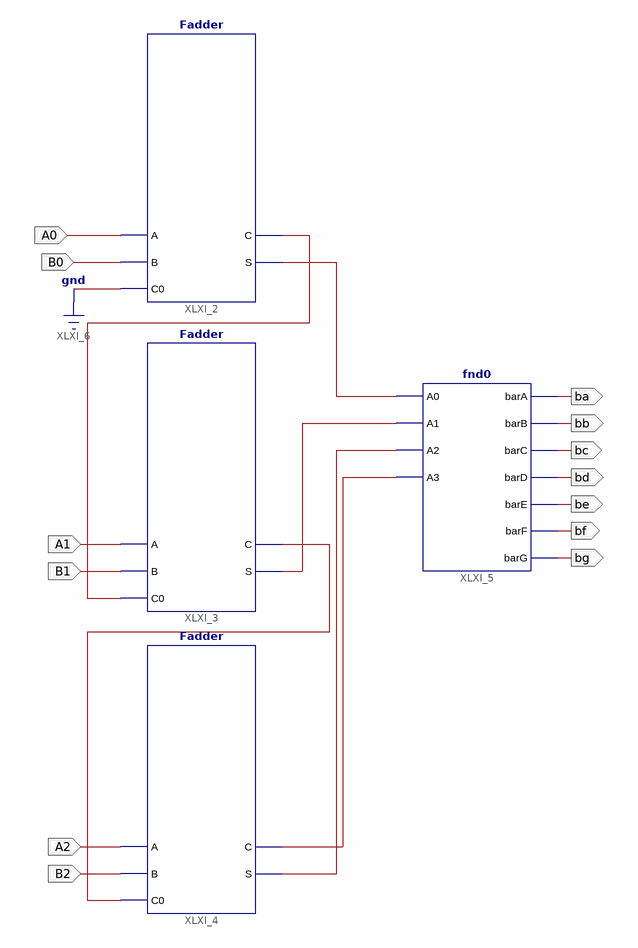
[diagram p0: schematic sheet 1]
// Xilinx ISE schematic fadder31.sch (spartan6) as structural Verilog: 4 symbols, 13 ports
module fadder31 (
  input  A0,
  input  A2,
  input  B2,
  input  B1,
  input  A1,
  input  B0,
  output ba,
  output bb,
  output bc,
  output bd,
  output be,
  output bf,
  output bg
);

  wire XLXN_1, XLXN_3, XLXN_6, XLXN_7, XLXN_8, XLXN_9;

  Fadder XLXI_2 (.A(A0), .B(B0), .C0(1'b0), .C(XLXN_1), .S(XLXN_6));
  Fadder XLXI_3 (.A(A1), .B(B1), .C0(XLXN_1), .C(XLXN_3), .S(XLXN_7));
  Fadder XLXI_4 (.A(A2), .B(B2), .C0(XLXN_3), .C(XLXN_9), .S(XLXN_8));
  fnd0 XLXI_5 (
    .A0(XLXN_6), .A1(XLXN_7), .A2(XLXN_8), .A3(XLXN_9), .barA(ba), .barB(bb), .barC(bc), .barD(bd),
    .barE(be), .barF(bf), .barG(bg));
endmodule
